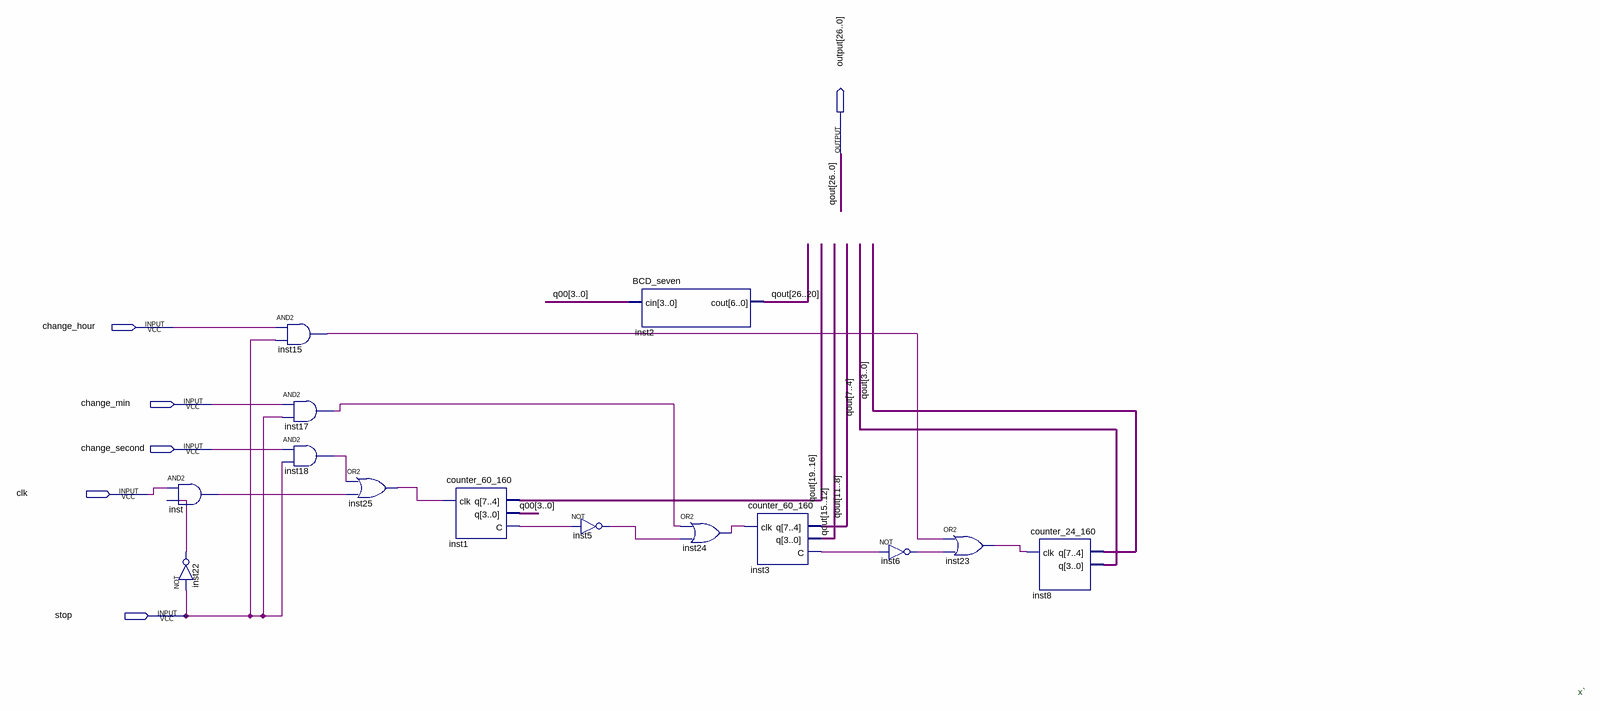
[diagram p0: schematic sheet]
// Quartus schematic time_core.bdf as structural Verilog: 14 symbols, 6 pins
module time_core (
  input  change_hour,
  input  change_min,
  input  change_second,
  input  clk,
  input  stop,
  output [26:0] \output 
);

  wire inst1_c, inst3_c, inst5_out, inst6_out, inst15_out, inst17_out, inst18_out, inst22_out, inst23_out,
       inst24_out, inst25_out, inst_out;
  wire [3:0] q00;

  and inst (inst_out, clk, inst22_out);
  not inst22 (inst22_out, stop);
  and inst15 (inst15_out, change_hour, stop);
  and inst17 (inst17_out, change_min, stop);
  and inst18 (inst18_out, change_second, stop);
  or inst25 (inst25_out, inst18_out, inst_out);
  counter_60_160 inst1 (.clk(inst25_out), .q({\output [19:16], q00}), .C(inst1_c));
  not inst5 (inst5_out, inst1_c);
  BCD_seven inst2 (.cin(q00), .cout(\output [26:20]));
  or inst24 (inst24_out, inst17_out, inst5_out);
  counter_60_160 inst3 (.clk(inst24_out), .q({\output [11:8], \output [15:12]}), .C(inst3_c));
  not inst6 (inst6_out, inst3_c);
  or inst23 (inst23_out, inst15_out, inst6_out);
  counter_24_160 inst8 (.clk(inst23_out), .q({\output [3:0], \output [7:4]}));

  // Other names for the same wires on the sheet: qout[26:0] = \output 

  // Notes on the sheet:
  //   x`
endmodule
